# EAGLE design LMP9100_v2.3 (EAGLE 7.7.0)
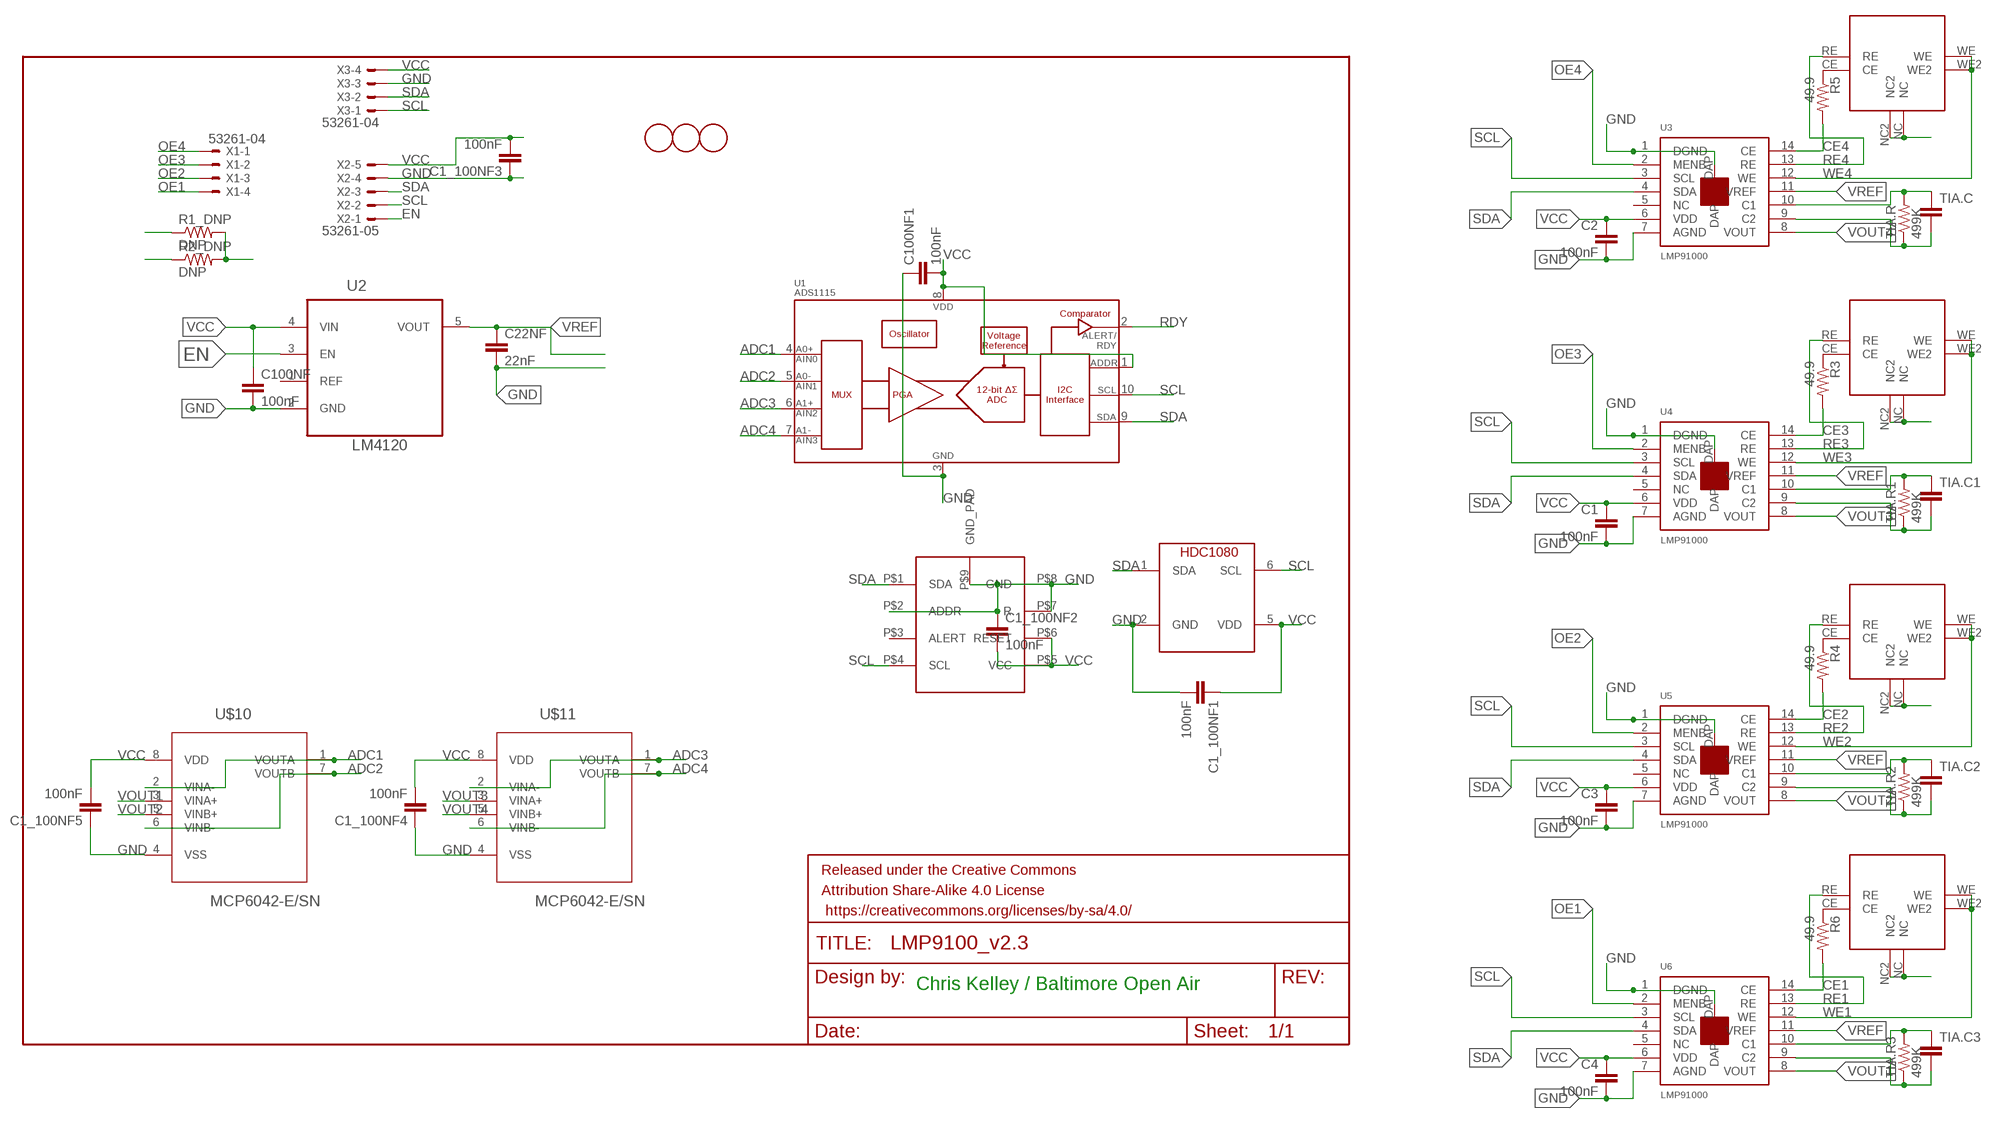
[diagram p0: schematic, sheet 1]

## Parts
C1  100nF  CAP0603-CAP  [0603-CAP]
C1_100NF1  100nF  CAP0603-CAP  [0603-CAP]
C1_100NF2  100nF  CAP0603-CAP  [0603-CAP]
C1_100NF3  100nF  CAP0603-CAP  [0603-CAP]
C1_100NF4  100nF  CAP0603-CAP  [0603-CAP]
C1_100NF5  100nF  CAP0603-CAP  [0603-CAP]
C2  100nF  CAP0603-CAP  [0603-CAP]
C3  100nF  CAP0603-CAP  [0603-CAP]
C4  100nF  CAP0603-CAP  [0603-CAP]
C22NF  22nF  CAP0603-CAP  [0603-CAP]
C100NF  100nF  CAP0603-CAP  [0603-CAP]
C100NF1  100nF  CAP0603-CAP  [0603-CAP]
FRAME1  FRAME-LETTER  [CREATIVE_COMMONS]
R1_DNP  DNP  RESISTOR0603-RES  [0603-RES]
R2_DNP  DNP  RESISTOR0603-RES  [0603-RES]
R3  49.9  RESISTOR0603-RES  [0603-RES]
R4  49.9  RESISTOR0603-RES  [0603-RES]
R5  49.9  RESISTOR0603-RES  [0603-RES]
R6  49.9  RESISTOR0603-RES  [0603-RES]
TIA.C  CAP0603-CAP  [0603-CAP]
TIA.C1  CAP0603-CAP  [0603-CAP]
TIA.C2  CAP0603-CAP  [0603-CAP]
TIA.C3  CAP0603-CAP  [0603-CAP]
TIA.R  499K  RESISTOR0603-RES  [0603-RES]
TIA.R1  499K  RESISTOR0603-RES  [0603-RES]
TIA.R2  499K  RESISTOR0603-RES  [0603-RES]
TIA.R3  499K  RESISTOR0603-RES  [0603-RES]
U1  ADS1115  ADS1015  [MSOP10]
U2  LM4120  LM4120AIM5-2.5  [SOT95P284X122-5N]
U3  LMP91000  [LMP91000]
U4  LMP91000  [LMP91000]
U5  LMP91000  [LMP91000]
U6  LMP91000  [LMP91000]
U$1  FIDUCIAL  [FIDUCIAL_1MM]
U$2  SHT31-D  [SHT31-D]
U$3  HDC1080  [WSON-6-PAD]
U$4  SPEC-SENSOR  [SPEC-SENSOR]
U$5  SPEC-SENSOR  [SPEC-SENSOR]
U$6  FIDUCIAL  [FIDUCIAL_1MM]
U$7  FIDUCIAL  [FIDUCIAL_1MM]
U$8  SPEC-SENSOR  [SPEC-SENSOR]
U$9  SPEC-SENSOR  [SPEC-SENSOR]
U$10  MCP6042-E/SN  [SOIC127P600X175-8N]
U$11  MCP6042-E/SN  [SOIC127P600X175-8N]
X1  53261-04  [53261-04]
X2  53261-05  [53261-05]
X3  53261-04  [53261-04]

## Nets
ADC1: U1.4(AIN0) U$10.1(VOUTA) U$10.2(VINA-)
ADC2: U1.5(AIN1) U$10.6(VINB-) U$10.7(VOUTB)
ADC3: U1.6(AIN2) U$11.1(VOUTA) U$11.2(VINA-)
ADC4: U1.7(AIN3) U$11.6(VINB-) U$11.7(VOUTB)
CE1: R6.2 U6.14(CE)
CE2: R4.2 U5.14(CE)
CE3: R3.2 U4.14(CE)
CE4: R5.2 U3.14(CE)
EN: U2.3(EN) X2.1
GND: C1.2 C1_100NF1.2 C1_100NF2.1 C1_100NF3.1 C1_100NF4.1 C1_100NF5.1 C2.2 C3.2 C4.2 C22NF.2 C100NF1.1 C100NF.2 U1.3(VSS) U2.2(GND) U3.1(DGND) U3.7(AGND) U3.DAP U4.1(DGND) U4.7(AGND) U4.DAP U5.1(DGND) U5.7(AGND) U5.DAP U6.1(DGND) U6.7(AGND) U6.DAP U$2.P$2(ADDR) U$2.P$7(R) U$2.P$8(GND) U$2.P$9(GND_PAD) U$3.2(GND) U$4.NC U$4.NC2 U$5.NC U$5.NC2 U$8.NC U$8.NC2 U$9.NC U$9.NC2 U$10.4(VSS) U$11.4(VSS) X2.4 X3.3
N$1: R5.1 U$4.CE
N$2: R3.1 U$5.CE
N$3: R4.1 U$8.CE
N$4: R6.1 U$9.CE
OE1: U6.2(MENB) X1.4
OE2: U5.2(MENB) X1.3
OE3: U4.2(MENB) X1.2
OE4: U3.2(MENB) X1.1
RDY: U1.2(ALERT/RDY)
RE1: U6.13(RE) U$9.RE
RE2: U5.13(RE) U$8.RE
RE3: U4.13(RE) U$5.RE
RE4: U3.13(RE) U$4.RE
SCL: R1_DNP.1 U1.10(SCL) U3.3(SCL) U4.3(SCL) U5.3(SCL) U6.3(SCL) U$2.P$4(SCL) U$3.6(SCL) X2.2 X3.1
SDA: R2_DNP.1 U1.9(SDA) U3.4(SDA) U4.4(SDA) U5.4(SDA) U6.4(SDA) U$2.P$1(SDA) U$3.1(SDA) X2.3 X3.2
TIA1: TIA.C.1 TIA.R.2 U3.10(C1)
TIA2: TIA.C.2 TIA.R.1 U3.9(C2)
TIA3: TIA.C1.1 TIA.R1.2 U4.10(C1)
TIA4: TIA.C1.2 TIA.R1.1 U4.9(C2)
TIA5: TIA.C2.1 TIA.R2.2 U5.10(C1)
TIA6: TIA.C2.2 TIA.R2.1 U5.9(C2)
TIA7: TIA.C3.1 TIA.R3.2 U6.10(C1)
TIA8: TIA.C3.2 TIA.R3.1 U6.9(C2)
VCC: C1.1 C1_100NF1.1 C1_100NF2.2 C1_100NF3.2 C1_100NF4.2 C1_100NF5.2 C2.1 C3.1 C4.1 C100NF1.2 C100NF.1 R1_DNP.2 R2_DNP.2 U1.1(ADDR) U1.8(VDD) U2.4(VIN) U3.6(VDD) U4.6(VDD) U5.6(VDD) U6.6(VDD) U$2.P$5(VCC) U$2.P$6(RESET) U$3.5(VDD) U$10.8(VDD) U$11.8(VDD) X2.5 X3.4
VOUT1: U6.8(VOUT) U$10.3(VINA+)
VOUT2: U5.8(VOUT) U$10.5(VINB+)
VOUT3: U4.8(VOUT) U$11.3(VINA+)
VOUT4: U3.8(VOUT) U$11.5(VINB+)
VREF: C22NF.1 U2.5(VOUT) U3.11(VREF) U4.11(VREF) U5.11(VREF) U6.11(VREF)
WE1: U6.12(WE) U$9.WE U$9.WE2
WE2: U5.12(WE) U$8.WE U$8.WE2
WE3: U4.12(WE) U$5.WE U$5.WE2
WE4: U3.12(WE) U$4.WE U$4.WE2
Unconnected: U2.1(REF) U3.5(NC) U4.5(NC) U5.5(NC) U6.5(NC) U$2.P$3(ALERT)

## Notes on the sheet
- Chris Kelley / Baltimore Open Air

## Library data of the parts
C1 C1_100NF1-C1_100NF5 C2-C4 C22NF C100NF C100NF1 TIA.C TIA.C1-TIA.C3 = SparkFun-Passives:CAP: Capacitor Standard 0603 ceramic capacitor, and 0.1" leaded capacitor.
FRAME1 = SparkFun-Aesthetics:FRAME-LETTER: Schematic Frame Standard 8.5x11 US Letter frame
R1_DNP R2_DNP R3-R6 TIA.R TIA.R1-TIA.R3 = SparkFun-Passives:RESISTOR: Resistor Basic schematic elements and footprints for 0603, 1206, and PTH resistors.
U1 = SparkFun-AnalogIC:ADS1015: 12-Bit Del-Sig ADC Four single-ended inputs or two differential inputs Internal PGA I2C interface 2.0-5.5V; PROD_ID: IC-12239; VALUE: ADS1015
U2 = LM4120AIM5-2.5:LM4120AIM5-2.5: Dropout voltage reference; AVAILABILITY: Good; DESCRIPTION: Precision Micropower Low Dropout Voltage Reference 5-SOT-23 -40 to 85; MF: Texas Instruments; MP: LM4120AIM5-2.5/NOPB; PACKAGE: SOT-23 Texas Instruments; PRICE: 1.40 USD
U3-U6 = lmp91000:LMP91000
U$1 U$6 U$7 = adafruit:FIDUCIAL: For use by pick and place machines to calibrate the vision/machine, 1mm By microbuilder.eu
U$2 = awqua_eagle_library:SHT31-D
U$3 = WSON-6-PAD:HDC1080
U$4 U$5 U$8 U$9 = lmp91000:SPEC-SENSOR
U$10 U$11 = MCP6042-E_SN:MCP6042-E/SN: Op Amps; AVAILABILITY: Good; DESCRIPTION: MCP6042 Series 6 V 14 kHz Rail-to-Rail I/O Operational Amplifier -SOIC-8; MF: Microchip; MP: MCP6042-E/SN; PACKAGE: SOIC-8 Microchip; PRICE: 0.68 USD
X1 X3 = con-molex:53?-04: CONNECTOR wire to board 1.25 mm (.049 inch) pitch header; OC_FARNELL: 1125374; OC_NEWARK: unknown
X2 = con-molex:53?-05: CONNECTOR wire to board 1.25 mm (.049 inch) pitch header; OC_FARNELL: 1433644; OC_NEWARK: unknown

## Board
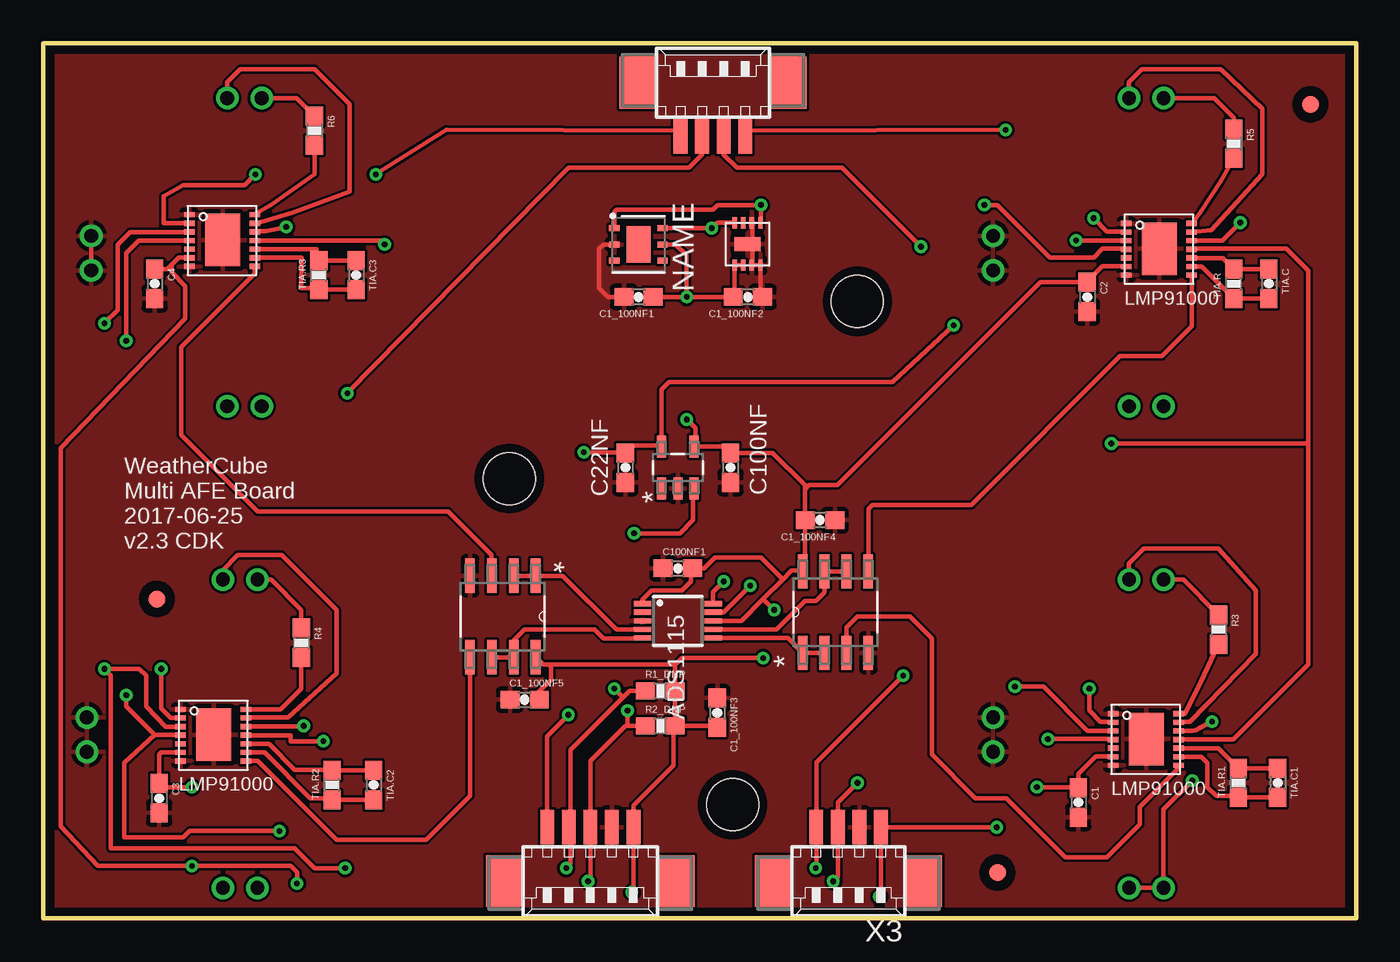
[diagram p1: board, top side]
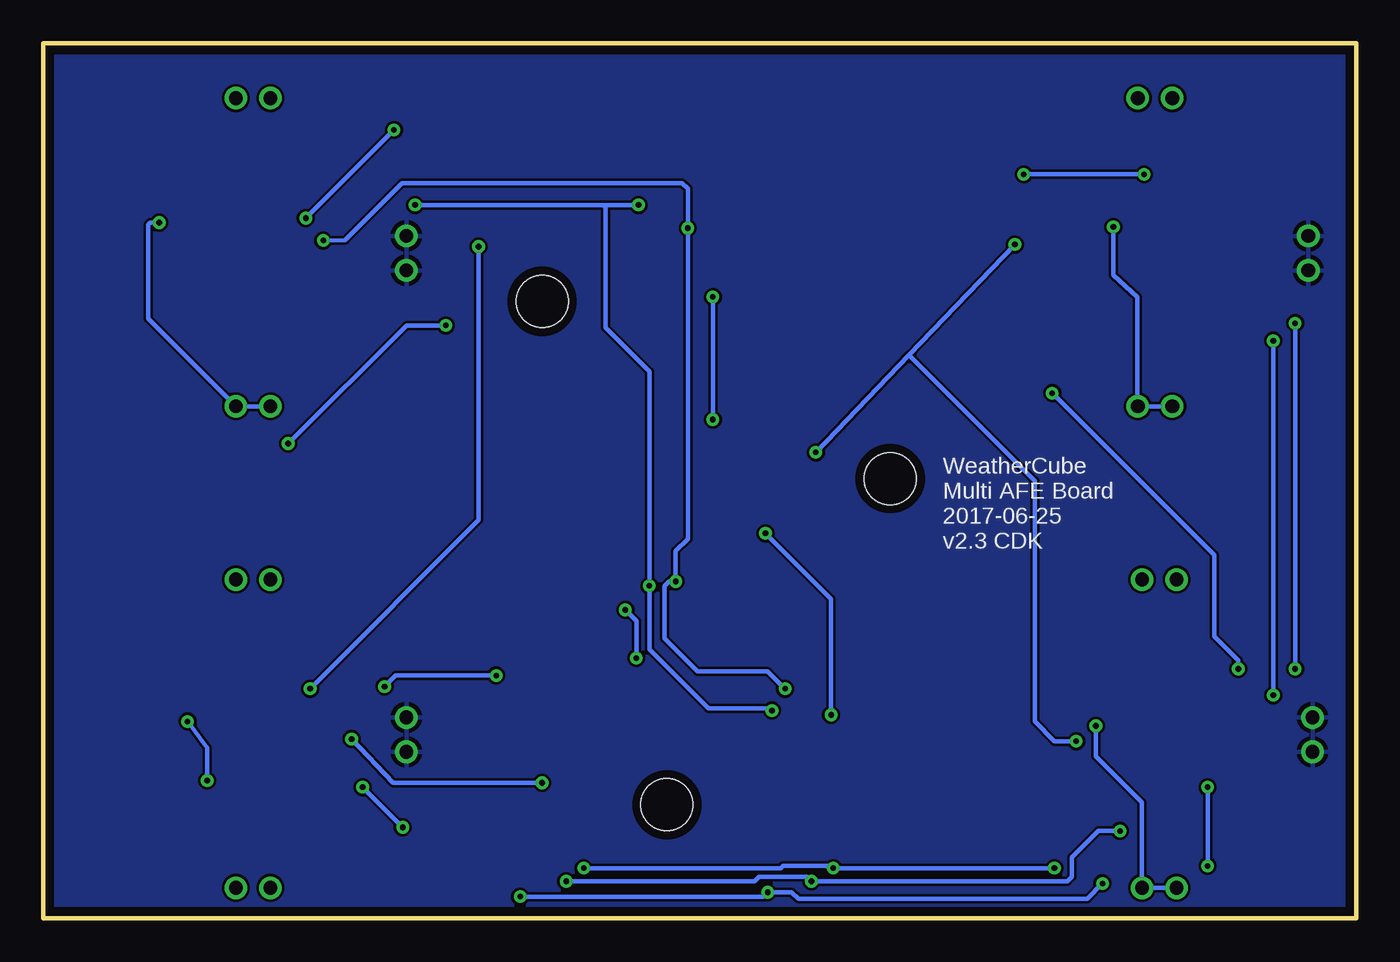
[diagram p2: board, bottom side, seen from below]

Size 76.2 x 50.8 mm. Coordinates in mm from the lower left corner, seen from the top.
Outline: 0,0 76.2,0 76.2,50.8 0,50.8 0,0
Copper layers (1*16): Top 0.035mm / dielectric 1.5mm / Bottom 0.035mm
Design rules "default *": minimum track width 6mil, minimum drill 12mil, track to track 6mil, track to pad 8mil, pad to pad 8mil, via to via 8mil, smd to smd 8mil, copper to edge 20mil, drill to drill 8mil, minimum pad ring 10mil, minimum via ring 8mil, stop-mask expansion 4mil, vias tented up to drill 13mil, thermal gap 10mil
Holes 3 mm at 27.05,25.53 40.01,6.6 47.24,35.81

### Footprints (pad centres in the part's own frame; a part is rotated, then mirrored left to right if it is on the bottom)
0603-CAP = smd 1.1 x 1: 1 -0.85,0; 2 0.85,0
0603-RES = smd 1.1 x 1: 1 -0.85,0; 2 0.85,0
MSOP10 = smd 0.3 x 1: 1 -1,-2.05; 2 -0.5,-2.05; 3 0,-2.05; 4 0.5,-2.05; 5 1,-2.05; 6 1,2.05; 7 0.5,2.05; 8 0,2.05; 9 -0.5,2.05; 10 -1,2.05
SOT95P284X122-5N = smd 1.27 x 0.533: 1 -1.219,0.94; 2 -1.219,0; 3 -1.219,-0.94; 4 1.219,-0.94; 5 1.219,0.94
LMP91000 = smd 0.61 x 0.305: 1 0.1,3.5; 2 0.1,3; 3 0.1,2.5; 4 0.1,2; 5 0.1,1.5; 6 0.1,1; 7 0.1,0.5; 8 3.9,0.5; 9 3.9,1; 10 3.9,1.5; 11 3.9,2; 12 3.9,2.5; 13 3.9,3; 14 3.9,3.5 | smd 2.032 x 3.048: DAP 2.032,2.032
FIDUCIAL_1MM = smd 1 x 1: 1 0,0
SHT31-D = smd 0.65 x 0.25: P$1 0.025,2; P$2 0.025,1.5; P$3 0.025,1; P$4 0.025,0.5; P$5 2.475,0.5; P$6 2.475,1; P$7 2.475,1.5; P$8 2.475,2 | smd 0.8 x 1.5: P$9 1.25,1.25
WSON-6-PAD = smd 0.35 x 0.6: 1 -0.95,-1.4; 2 0,-1.4; 3 0.95,-1.4; 4 0.95,1.4; 5 0,1.4; 6 -0.95,1.4 | smd 2.1 x 1.4: PAD 0,0
SPEC-SENSOR = drill 0.8: CE 17.89,-1; NC 7.89,8.89; NC2 9.89,8.89; RE 17.89,1; WE 0,-1; WE2 0,1
SOIC127P600X175-8N = smd 1.981 x 0.559: 1 -2.362,1.905; 2 -2.362,0.635; 3 -2.362,-0.635; 4 -2.362,-1.905; 5 2.362,-1.905; 6 2.362,-0.635; 7 2.362,0.635; 8 2.362,1.905
53261-04 = smd 0.8 x 2: 1 1.875,-2.5; 2 0.625,-2.5; 3 -0.625,-2.5; 4 -1.875,-2.5 | smd 2.1 x 3: S1 4.375,0.625; S2 -4.375,0.625
53261-05 = smd 0.8 x 2: 1 2.5,-2.5; 2 1.25,-2.5; 3 0,-2.5; 4 -1.25,-2.5; 5 -2.5,-2.5 | smd 2.1 x 3: S1 5,0.625; S2 -5,0.625

### Placement (x,y rotation side)
C1  60.07,6.73 270 top
C1_100NF1  34.54,36.07 180 top
C1_100NF2  40.89,36.07 180 top
C1_100NF3  39.12,11.94 270 top
C1_100NF4  45.09,23.11 180 top
C1_100NF5  27.94,12.7 0 top
C2  60.58,36.07 270 top
C3  6.73,6.99 270 top
C4  6.48,36.83 270 top
C22NF  33.78,26.16 270 top
C100NF  39.88,26.16 270 top
C100NF1  36.83,20.32 0 top
FRAME1  4.83,-27.69 0 top  (outside the outline)
R1_DNP  35.81,13.21 0 top
R2_DNP  35.81,11.18 0 top
R3  68.2,16.76 270 top
R4  14.99,16 270 top
R5  69.09,44.96 270 top
R6  15.75,45.72 270 top
TIA.C  71.12,36.83 270 top
TIA.C1  71.63,7.87 270 top
TIA.C2  19.18,7.75 270 top
TIA.C3  18.16,37.34 270 top
TIA.R  69.09,36.83 90 top
TIA.R1  69.34,7.87 90 top
TIA.R2  16.76,7.75 90 top
TIA.R3  16,37.34 90 top
U1  36.83,17.27 270 top
U2  36.83,26.16 90 top
U3  62.74,36.83 0 top
U4  61.98,8.38 0 top
U5  7.87,8.64 0 top
U6  8.38,37.34 0 top
U$1  6.6,18.54 0 top
U$2  39.62,40.39 270 top
U$3  34.54,39.12 270 top
U$4  64.01,29.72 90 top
U$5  64.01,1.78 90 top
U$6  73.53,47.24 0 top
U$7  55.37,2.67 0 top
U$8  11.43,1.78 90 top
U$9  11.68,29.72 90 top
U$10  26.67,17.53 270 top
U$11  45.97,17.78 90 top
X1  38.86,47.88 0 top
X2  31.75,2.79 180 top
X3  46.74,2.79 180 top

### Tracks (layer width: path | path; a pad name or v marks a point on that pad's centre or on a via)
ADC1
  Top 0.254: U$10.2 U$10.1 30.15,19.89 33.27,16.76 U1.4
ADC2
  Top 0.254: U1.5 34.76,16.26 32.51,16.26 32,16.76 27.94,16.76 27.3,16.13 U$10.7 U$10.6
ADC3
  Top 0.254: U$11.2 U$11.1 43.22,16.27 U1.6
ADC4
  Top 0.254: U1.7 42.55,16.77 44.2,18.41 44.83,18.41 45.34,18.92 U$11.7 U$11.6
CE1
  Top 0.254: R6.2 15.75,43.18 13.21,41.4 12.34,40.89 U6.14
CE2
  Top 0.254: U5.14 13.79,12.14 14.99,13.34 R4.2
CE3
  Top 0.254: U4.14 66.24,11.88 67.18,13.72 R3.2
CE4
  Top 0.254: R5.2 68.33,42.8 67.18,41.02 66.69,40.39 U3.14
EN  (via drill 0.33)
  Top 0.254: X2.1 29.25,10.58 v30.48,11.81 | v34.29,22.35 36.96,22.35 37.72,23.11 37.72,24.89 U2.3
  Bottom 0.254: v30.48,11.81 30.48,18.54 v34.29,22.35
GND
  Top 0.254: U$3.2 32.51,39.12 32.26,38.86 32.26,36.58 32.77,36.07 C1_100NF1.2 | U$2.P$2 41.15,40.34 41.15,39.37 40.91,39.14 U$2.P$9 41.15,38.86 41.15,37.94 U$2.P$7 U$2.P$8 41.62,36.19 C1_100NF2.1 | U5.7 | U$9.NC2 U$9.NC
  pour Top: -7.87,58.42 81.79,58.17 82.3,-10.67 -7.87,-11.18
  pour Bottom: -6.73,59.18 83.69,59.94 82.42,-3.81 -5.71,-5.33
N$1
  Top 0.254: U$4.CE 67.96,47.61 69.09,46.48 R5.1
N$2
  Top 0.254: U$5.CE 66.14,19.67 R3.1
N$3
  Top 0.254: U$8.CE 13.22,19.67 14.99,17.91 R4.1
N$4
  Top 0.254: U$9.CE 14.71,47.61 R6.1
OE1  (via drill 0.33)
  Top 0.254: U6.2 6.99,40.34 6.99,41.91 8.13,42.55 11.68,42.55 v12.32,43.18 | X1.4 36.96,45.38 36.96,45.72 23.41,45.76 v19.3,43.18
  Bottom 0.254: v19.3,43.18 v12.32,43.18
OE2  (via drill 0.33)
  Top 0.254: U5.2 7.41,11.64 6.86,12.19 v6.86,14.48 | X1.3 38.24,44.33 37.47,43.56 30.48,43.56 v17.65,30.48
  Bottom 0.254: v6.86,14.48 6.86,14.99 8.26,16.38 8.26,21.08 v17.65,30.48
OE3  (via drill 0.33)
  Top 0.254: X1.2 39.49,44.33 40.26,43.56 46.35,43.56 v50.93,38.99 | v60.71,13.34 60.71,12.06 61.34,11.4 62.03,11.4 U4.2
  Bottom 0.254: v50.93,38.99 50.93,23.11 v60.71,13.34
OE4  (via drill 0.33)
  Top 0.254: X1.1 40.89,45.38 40.89,45.72 v55.84,45.76 | v60.96,40.64 61.72,39.85 62.79,39.85 U3.2
  Bottom 0.254: v55.84,45.76 v60.96,40.64
RE1
  Top 0.254: U$9.RE 10.68,48.53 11.43,49.28 15.75,49.28 17.78,47.24 17.78,42.16 14.48,40.96 12.33,40.32 U6.13
RE2
  Top 0.254: U$8.RE 10.43,20.21 11.3,21.08 13.84,21.08 17.02,17.91 17.02,14.22 14.22,11.68 11.82,11.68 U5.13
RE3
  Top 0.254: U$5.RE 63.01,20.59 63.88,21.46 68.2,21.46 70.36,19.05 70.36,15.37 66.55,11.4 66.05,11.4 U4.13
RE4
  Top 0.254: U$4.RE 63.01,48.53 63.75,49.28 68.33,49.28 70.74,46.99 70.74,43.18 67.77,39.96 U3.13
SCL  (via drill 0.33)
  Top 0.254: U$3.6 v38.8,40.07 39.12,40.39 40.1,40.39 U$2.P$4 | U6.3 5.04,39.84 4.32,39.12 4.32,35.31 v3.56,34.54 | v59.94,39.34 62.8,39.34 U3.3 | R1_DNP.1 34.04,13.21 33.66,12.83 | 33.66,12.83 30.61,9.78 30.61,5.4 | U5.3 7.93,11.12 7.11,11.12 5.97,12.32 5.97,14.1 5.59,14.48 v3.56,14.48 3.94,14.1 3.94,4.06 14.61,4.06 15.75,2.92 v17.53,2.92 | 30.61,5.4 30.61,3.17 v30.35,2.92 | v49.91,14.1 44.86,9.05 X3.1 44.86,2.95 v44.83,2.92 | v56.39,13.46 58.04,13.46 60.58,10.9 62.04,10.9 U4.3 | 30.61,5.4 X2.2 | U1.10 38.88,18.94 v39.5,19.56 | v33.15,13.34 33.66,12.83
  Bottom 0.254: v59.94,39.34 58.67,39.37 55.37,42.67 39.12,42.67 38.8,42.35 v38.8,40.07 38.8,22.04 39.5,21.34 v39.5,19.56 39.88,19.56 40.13,19.3 40.13,16.26 38.23,14.35 34.16,14.35 v33.15,13.34 | v3.56,34.54 v3.56,14.48 | v17.53,2.92 v30.35,2.92 30.48,3.05 33.27,3.05 33.4,2.92 v44.83,2.92 | v49.91,14.1 55.75,14.1 v56.39,13.46
SDA  (via drill 0.33)
  Top 0.254: U$3.1 33.14,41.02 33.27,41.15 38.86,41.15 39.12,41.4 v41.66,41.4 41.66,40.39 U$2.P$1 | U6.4 5.56,39.34 4.83,38.61 v4.83,33.53 | U3.4 62.81,38.86 61.47,38.86 60.96,38.35 58.42,38.35 55.37,41.4 v54.61,41.4 | 33.91,11.18 33.78,11.18 31.75,9.14 X2.3 31.75,2.29 v31.62,2.16 | 33.91,11.18 R2_DNP.1 | v4.83,12.95 4.83,12.32 6.48,10.64 | 6.48,10.64 7.94,10.64 U5.4 | v13.72,5.08 8.51,5.08 8.13,4.7 4.7,4.7 4.7,9.02 6.48,10.64 | v47.24,7.87 46.11,6.74 X3.2 46.11,2.42 v45.85,2.16 | v58.29,10.41 62.04,10.41 U4.4 | U1.9 39.49,17.77 v41.02,19.3 | v33.91,12.06 33.91,11.18
  Bottom 0.254: v4.83,12.95 v4.83,33.53 | v13.72,5.08 14.99,5.08 16.51,3.56 16.51,2.41 16.76,2.16 v31.62,2.16 31.88,2.41 34.67,2.41 34.92,2.16 v45.85,2.16 | v41.66,41.4 43.69,41.4 | 43.69,41.4 v54.61,41.4 | v47.24,7.87 55.88,7.87 v58.29,10.41 | v33.91,12.06 34.04,12.19 37.59,12.19 41.02,15.62 v41.02,19.3 41.02,31.75 43.56,34.29 43.56,41.27 43.69,41.4
TIA1
  Top 0.254: U3.10 68.44,38.33 TIA.R.2 TIA.C.1
TIA2
  Top 0.254: U3.9 67.24,37.83 TIA.R.1 TIA.C.2
TIA3
  Top 0.254: U4.10 68.18,9.88 TIA.R1.2 TIA.C1.1
TIA4
  Top 0.254: U4.9 67.2,9.38 67.56,9.02 67.56,7.62 68.07,7.11 69.25,7.11 TIA.R1.1 TIA.C1.2
TIA5
  Top 0.254: U5.10 13.11,10.14 14.61,8.64 16.73,8.64 TIA.R2.2 TIA.C2.1
TIA6
  Top 0.254: U5.9 12.84,9.64 15.49,6.99 16.68,6.99 TIA.R2.1 TIA.C2.2
TIA7
  Top 0.254: U6.10 15.88,38.84 15.88,38.23 15.89,38.08 TIA.R3.2 TIA.C3.1
TIA8
  Top 0.254: U6.9 15,38.34 14.99,36.58 15.91,36.58 TIA.R3.1 TIA.C3.2
VCC  (via drill 0.33)
  Top 0.254: C1_100NF1.1 v37.34,36.07 | v37.34,36.07 C1_100NF2.2 40.12,36.15 U$2.P$5 U$2.P$6 | R2_DNP.2 36.58,11.09 36.58,8.89 34.25,6.56 X2.5 34.25,1.61 v34.16,1.52 | R2_DNP.2 R1_DNP.2 36.66,14.64 36.58,14.73 | R2_DNP.2 39.03,11.18 C1_100NF3.2 | 36.58,14.73 29.34,14.73 | 29.34,14.73 29.01,14.73 U$10.8 | 7.45,37.93 7.87,38.35 8.47,38.35 U6.6 | U3.6 62.82,37.85 61.47,37.85 60.58,36.96 C2.1 57.87,36.92 46.1,25.15 44.45,25.15 44.2,24.89 | U5.6 7.96,9.65 6.86,9.65 6.73,9.53 C3.1 7.2,7.62 v8.64,7.62 | 44.2,24.89 44.2,25.15 42.33,27.01 C100NF.1 39.51,27.38 U2.4 37.85,27.46 37.85,28.45 v37.34,28.96 | 44.2,24.89 44.2,23.11 | 44.2,23.11 44.2,20.27 U$11.8 44.02,20.19 43.43,20.19 42.93,19.68 | U1.8 40.51,17.27 41.78,18.54 | 41.78,18.54 42.93,19.68 | U4.6 62.06,9.4 61.09,9.4 60.07,8.38 C1.1 60.03,7.62 v57.66,7.62 | v55.33,5.29 X3.4 48.61,1.37 v48.51,1.27 | U$3.5 36.7,39.12 37.34,38.48 v37.34,36.07 | v14.73,2.03 14.73,2.67 14.35,3.05 v8.64,3.05 3.17,3.05 1.02,5.33 1.02,27.3 8.26,34.8 8.26,36.7 7.45,37.5 7.45,37.93 | 42.93,19.68 41.66,20.95 38.99,20.95 38.35,20.32 C100NF1.2 37.59,20.23 37.59,19.56 37.08,19.05 35.31,19.05 34.78,18.52 U1.1 | 36.58,14.73 36.7,14.73 37.08,15.11 v41.78,15.11 | v42.42,17.91 41.78,18.54 | C4.1 7.2,37.68 7.45,37.93 | C1_100NF5.2 28.79,13.17 29.46,13.84 29.46,14.61 29.34,14.73 | C1_100NF4.2 44.2,23.11
  Bottom 0.254: v55.33,5.29 v57.66,7.62 | v14.73,2.03 15.62,1.14 32.38,1.14 32.77,1.52 v34.16,1.52 34.42,1.27 v48.51,1.27 | v8.64,3.05 v8.64,7.62 | v37.34,36.07 v37.34,28.96 | v41.78,15.11 41.78,17.27 v42.42,17.91
VOUT1
  Top 0.254: U6.8 12.28,37.43 8,33.15 8,28.07 12.45,23.62 23.5,23.62 26.04,21.08 U$10.3
VOUT2
  Top 0.254: U5.8 12.45,9.14 17.02,4.57 22.23,4.57 24.77,7.11 U$10.5
VOUT3
  Top 0.254: U$11.3 46.61,16.89 47.24,17.53 50.16,17.53 50.29,17.53 50.42,17.4 51.56,16.26 51.56,9.53 54.1,6.99 55.88,6.99 59.31,3.56 61.72,3.56 63.63,5.46 63.63,6.48 65.88,8.73 U4.8
VOUT4
  Top 0.254: U3.8 66.64,34.38 64.9,32.64 62.48,32.64 53.85,24 48.13,24 47.88,23.75 U$11.5
VREF  (via drill 0.33)
  Top 0.254: U6.11 19.59,39.34 v19.81,39.12 | U5.11 14.35,10.64 14.35,10.29 v16.26,10.29 | U4.11 69.06,10.38 73.41,14.73 73.41,27.69 | v31.37,27.05 33.74,27.05 C22NF.1 33.87,27.01 34.29,27.43 35.84,27.43 U2.5 35.89,30.68 36.32,31.11 49.28,31.11 v52.83,34.42 | 73.41,27.69 73.41,37.59 72.14,38.86 66.67,38.86 U3.11 | v61.98,27.56 73.28,27.56 73.41,27.69
  Bottom 0.254: v19.81,39.12 25.97,32.69 | 25.97,32.69 v31.37,27.05 | v16.26,10.29 17.53,10.29 18.67,11.43 18.67,25.39 25.97,32.69 | v52.83,34.42 55.12,34.42 v61.98,27.56
WE1  (via drill 0.33)
  Top 0.254: v14.1,40.13 12.95,39.88 12.62,39.88 U6.12
  Bottom 0.254: v14.1,40.13 14.1,37.34 12.7,36.07 12.7,29.96 U$9.WE U$9.WE2
WE2  (via drill 0.33)
  Top 0.254: U5.12 15.07,11.14 v15.11,11.18
  Bottom 0.254: v15.11,11.18 15.11,9.4 12.45,6.73 12.45,1.79 U$8.WE U$8.WE2
WE3  (via drill 0.33)
  Top 0.254: U$5.WE2 U$5.WE 65.01,6.33 v66.67,8 | v67.82,11.43 66.85,10.92 66.69,10.88 U4.12
  Bottom 0.254: v66.67,8 66.67,9.91 v67.82,11.43
WE4  (via drill 0.33)
  Top 0.254: U3.12 68.41,39.33 v69.47,40.39
  Bottom 0.254: v69.47,40.39 69.98,40.39 70.1,40.26 70.1,34.81 U$4.WE U$4.WE2

### Text on the board
tNames: WeatherCube / Multi AFE Board / 2017-06-25 / v2.3 CDK | Chris Kelley / Baltimore Open Air
bNames: WeatherCube / Multi AFE Board / 2017-06-25 / v2.3 CDK